# Altium schematic sheet H_bridge.SchDoc: Coil_Driver
size A4; Author: Amalnath R N; CompanyName: Bartosat; DrawnBy: Amalnath R N; Engineer: Electrical; Revision: 1.0; SheetNumber: 2; SheetTotal: 2
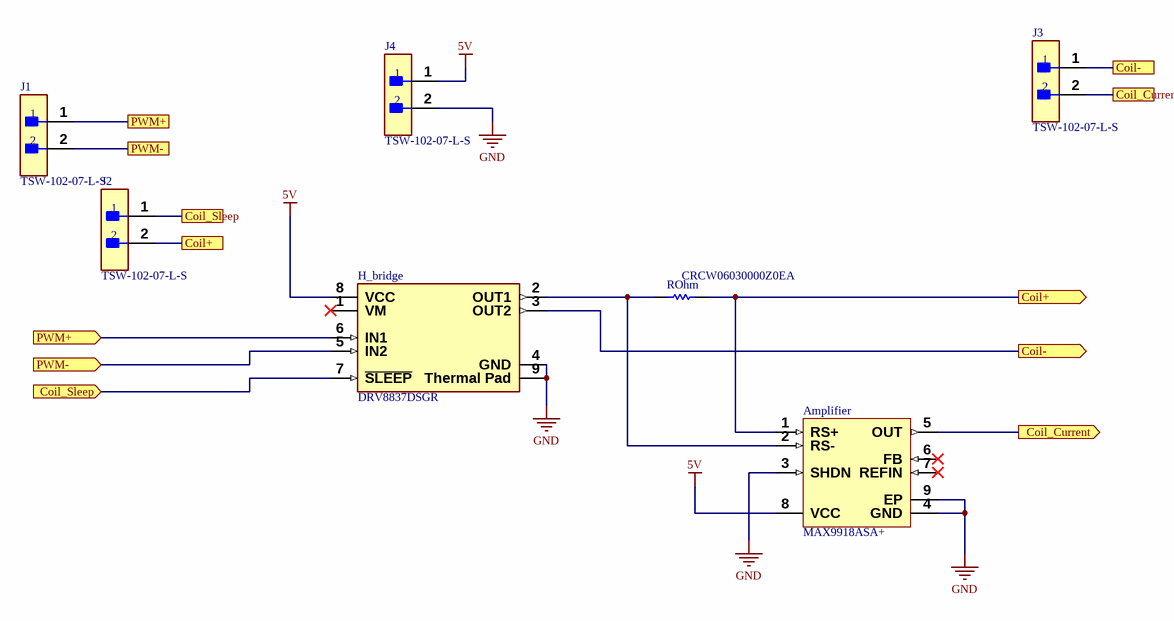
[diagram p0: H_bridge.SchDoc]

## Parts
Amplifier  MAX9918ASA+  [MAXM-S8E+14_L]
H_bridge  DRV8837DSGR  [FP-DSG0008A-MFG]
J1  TSW-102-07-L-S  [FP-TSW-102-07-L-S-MFG]
J2  TSW-102-07-L-S  [FP-TSW-102-07-L-S-MFG]
J3  TSW-102-07-L-S  [FP-TSW-102-07-L-S-MFG]
J4  TSW-102-07-L-S  [FP-TSW-102-07-L-S-MFG]
ROhm  CRCW06030000Z0EA  [RESC1609X50X30NL8T20]

## Ports
Coil+, Coil+ (out), Coil-, Coil- (out), Coil_Current, Coil_Current (out), Coil_Sleep, Coil_Sleep (in), PWM+, PWM+ (in), PWM-, PWM- (in)

## Nets
5V: Amplifier.8(VCC) H_bridge.8(VCC) J4.1
GND: Amplifier.3(SHDN) Amplifier.4(GND) Amplifier.9(EP) H_bridge.4(GND) H_bridge.9(Thermal_Pad) J4.2
Coil+: Amplifier.1(RS+) J2.2 ROhm.2 ; port Coil+
Coil-: H_bridge.3(OUT2) J3.1 ; port Coil-
Coil_Current: Amplifier.5(OUT) J3.2 ; port Coil_Current
Coil_Sleep: H_bridge.7(~{SLEEP}) J2.1 ; port Coil_Sleep
PWM+: H_bridge.6(IN1) J1.1 ; port PWM+
PWM-: H_bridge.5(IN2) J1.2 ; port PWM-
NetAmplifier_2: Amplifier.2(RS-) H_bridge.2(OUT1) ROhm.1

Not connected (* = marked no-connect by the designer): Amplifier 6(FB)* 7(REFIN)*; H_bridge 1(VM)*

## Library data of the parts
Amplifier = CMP-0252-00087-1: -20 to 75 V Input Range, Precision Uni- / Bidirectional, Current-Sense Amplifier, Adjustable Gain, -40 to 125 degC, 8-Pin SOIC (S8E+14), Pb-Free; Industry Qualified: Automotive - AECQ100, Automotive - General; Gain: Adj.; Bi-Dir. Curr. Sense: Yes; ComponentLink1URL: http://www.maximintegrated.com/; Code_JEDEC: MS-012; PartNumber: MAX9918ASA+; Mounting Technology: Surface Mount; ComponentLink3URL: http://pdfserv.maximintegrated.com/package_dwgs/21-0111.PDF; ComponentLink2URL: http://datasheets.maximintegrated.com/en/ds/MAX9918-MAX9920.pdf; ComponentLink1Description: Manufacturer URL; ComponentLink2Description: Datasheet; PackageVersion: Rev. E, 01/2009; PackageDescription: 8-Pin Small-Outline IC, Narrow, Body 3.9 x 4.89 mm, Exposed Pad 2.945 x 2.26 mm, Pitch 1.27 mm; PackageReference: S8E+14; DatasheetVersion: Rev. 4; ComponentLink3Description: Package Specification
H_bridge = CMP-04915-000004-1: IC MOTOR DRIVER PAR 8WSON; Manufacturer: Texas Instruments; Switching Frequency: 0-250kHz; Min Supply Voltage: 1.8V; Standoff Height: 0mm; Max Supply Voltage: 7V; Output Voltage: 0-11V; Motor Type: Brushed; Number Of Outputs: 2; Output Current: 1.8A; Max Junction Temp: +150°C; Nominal Supply Current: 300-700uA; Mouser Description: Motor / Motion / Ignition Controllers & Drivers 1.8A Low Vltg Brush DC Motor Driver; Device Class L2: Power Management ICs; Manufacturer Part Number: DRV8837DSGR; Temperature Range Low: -40°C; Lead Free: Yes; Height: 0.8mm; Device Class L3: Motor Drivers; Octopart: https://octopart.com/drv8837dsgr-texas+instruments-23786726; Package: DSG0008A; ComponentLink2URL: http://www.ti.com/lit/ds/symlink/drv8837.pdf; Temperature: -40°C to +85°C; Ambient Temperature Range Low: -40°C; ComponentLink2Description: Datasheet; Ambient Temperature Range High: +85°C; Device Class L1: Integrated Circuits (ICs); Category: IC; Temperature Range High: +85°C; RoHS: TRUE; Automotive: No; Digikey Description: IC MOTOR DRIVER PAR 8WSON
J1-J4 = CMP-02766-001428-1: CONN HEADER VERT 2POS 2.54MM; Voltage Rating: 550V; Current Rating: 7.6A; Gender: Male; Number of Contacts: 2; Connector Type: Male Pin; Radiation Hardening: No; Orientation: Straight; Contact Plating: Gold; Max Operating Temperature: 125°C; Mount: Through Hole; Package Quantity: 1; Number of Rows: 1; Housing Material: Polyester; RoHS Compliant: Yes; Length: 5.08mm; Max Voltage Rating (AC): 550V; Pitch: 2.54mm; Packaging: Bulk; Depth: 2.54mm; Termination: Solder; Min Operating Temperature: -55°C; Housing Color: Black; Lead Free: Lead Free; Color: Black; Number of Positions: 2; Width: 2.54mm; Max Current Rating: 7.6A; REACH SVHC: No SVHC; Contact Material: Bronze; Contact Mating Length: 0.23inch; Series: TSW; Contact Type: Male Pin
ROhm = CMP-2000-03816-5: Chip Resistor, 0 Ohm, Jumper, 100 mW, -55 to 155 degC, 0603 (1608 Metric), RoHS, Tape and Reel; Manufacturer: Vishay Semiconductor; Voltage Rating: 75 V; Package Quantity: 5000; DatasheetVersion: 06/2012; Min Operating Temperature: -55 degC; ComponentLink1URL: http://www.vishay.com/; Mounting Technology: Surface Mount; Height: 0.45 mm; ComponentLink1Description: Manufacturer URL; REACH SVHC: Unknown; PackageReference: 0603; Packaging: Tape and Reel; Max Operating Temperature: 155 degC; Mount: Surface Mount; ComponentLink2Description: Datasheet; PackageDescription: 2-Pin Surface Mount Device, Body 1.575 x 0.85 mm; Length: 1.55 mm; ComponentLink2URL: http://www.vishay.com/docs/20035/dcrcwe3.pdf; Pins: 2; RoHSCompliant: true